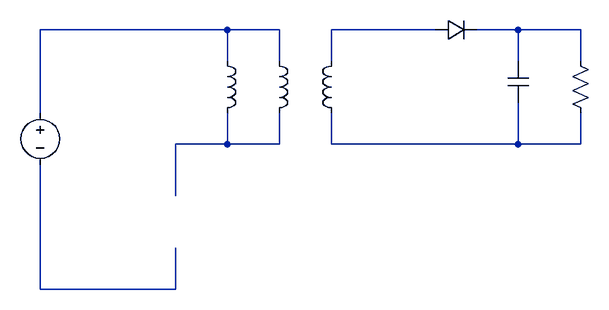
[diagram p0: schematic Draft2.asc]
Draft2.asc, the LTspice schematic file:
Version 4.1
SHEET 1 880 680
WIRE 32 96 -256 96
WIRE 112 96 32 96
WIRE 352 96 192 96
WIRE 480 96 416 96
WIRE 576 96 480 96
WIRE 32 144 32 96
WIRE 112 144 112 96
WIRE 192 144 192 96
WIRE 480 144 480 96
WIRE 576 144 576 96
WIRE -256 224 -256 96
WIRE 32 272 32 224
WIRE 32 272 -48 272
WIRE 112 272 112 224
WIRE 112 272 32 272
WIRE 192 272 192 224
WIRE 480 272 480 208
WIRE 480 272 192 272
WIRE 576 272 576 224
WIRE 576 272 480 272
WIRE -48 352 -48 272
WIRE -256 496 -256 304
WIRE -48 496 -48 432
WIRE -48 496 -256 496
SYMBOL ind 16 128 R0
WINDOW 0 36 40 Invisible 2
WINDOW 3 36 80 Invisible 2
SYMATTR InstName L1
SYMBOL ind 96 128 R0
WINDOW 0 36 40 Invisible 2
WINDOW 3 36 80 Invisible 2
SYMATTR InstName L2
SYMBOL ind 208 128 M0
WINDOW 0 36 40 Invisible 2
WINDOW 3 36 80 Invisible 2
SYMATTR InstName L3
SYMBOL diode 352 112 R270
WINDOW 0 32 32 Invisible 2
WINDOW 3 0 32 Invisible 2
SYMATTR InstName D1
SYMBOL cap 464 144 R0
WINDOW 0 24 8 Invisible 2
WINDOW 3 24 56 Invisible 2
SYMATTR InstName C1
SYMBOL res 560 128 R0
WINDOW 0 36 40 Invisible 2
WINDOW 3 36 76 Invisible 2
SYMATTR InstName R1
SYMBOL voltage -256 208 M0
WINDOW 0 24 16 Invisible 2
WINDOW 3 24 96 Invisible 2
SYMATTR InstName V1

The netlist it stands for:
* Draft2.asc
L1 N001 N004 L
L2 N001 N004 L
L3 N002 N005 L
D1 N002 N003 D
C1 N003 N005 C
R1 N003 N005 R
V1 N001 N006 V
.model D D
.lib standard.dio
.backanno
.end